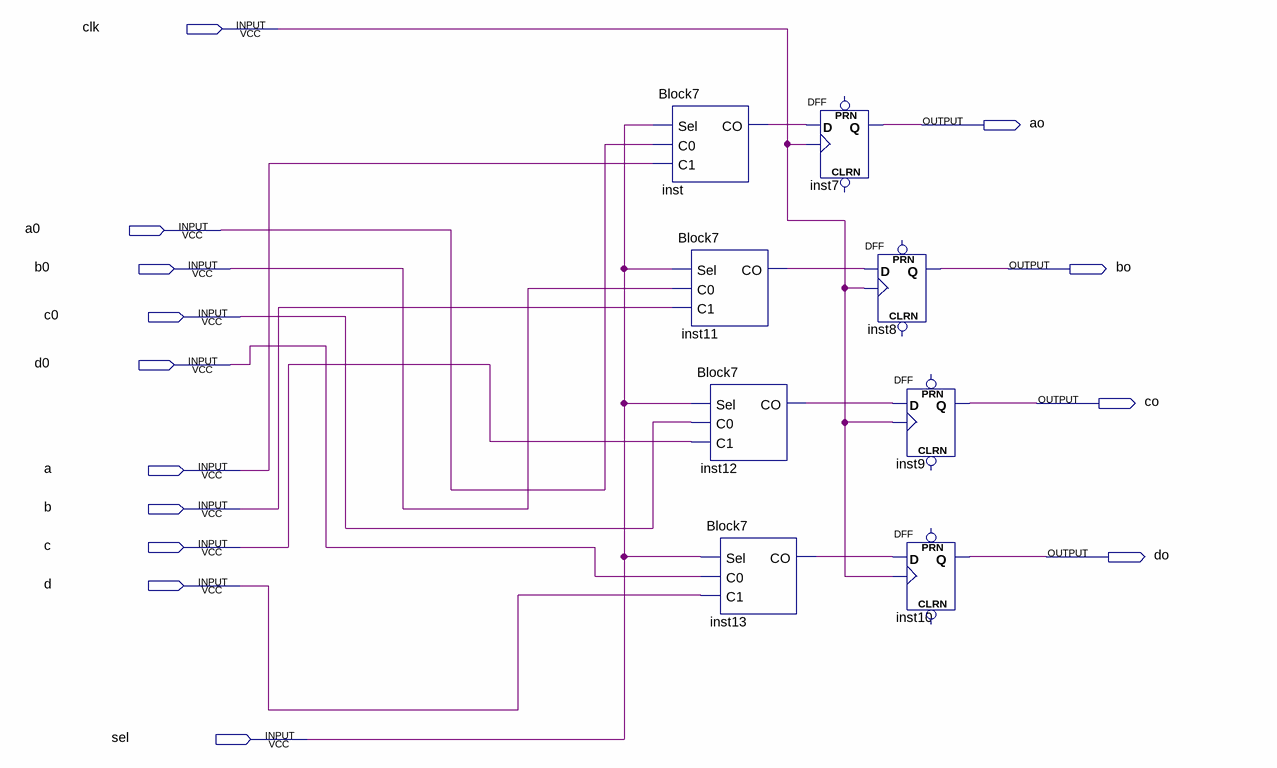
[diagram p0: schematic sheet]
// Quartus schematic Block10.bdf as structural Verilog: 8 symbols, 14 pins
module Block10 (
  input  clk,
  input  a0,
  input  b0,
  input  c0,
  input  d0,
  input  a,
  input  b,
  input  c,
  input  d,
  input  sel,
  output ao,
  output bo,
  output co,
  output \do 
);

  wire inst11_co, inst12_co, inst13_co, inst_co;

  Block7 inst (.Sel(sel), .C0(a0), .C1(a), .CO(inst_co));
  Block7 inst11 (.Sel(sel), .C0(b0), .C1(b), .CO(inst11_co));
  Block7 inst12 (.Sel(sel), .C0(c0), .C1(c), .CO(inst12_co));
  Block7 inst13 (.Sel(sel), .C0(d0), .C1(d), .CO(inst13_co));
  DFF inst7 (.CLK(clk), .D(inst_co), .Q(ao));  // open: CLRN, PRN
  DFF inst8 (.CLK(clk), .D(inst11_co), .Q(bo));  // open: CLRN, PRN
  DFF inst9 (.CLK(clk), .D(inst12_co), .Q(co));  // open: CLRN, PRN
  DFF inst10 (.CLK(clk), .D(inst13_co), .Q(\do ));  // open: CLRN, PRN
endmodule
